# Altium project stm8core.PrjPCB
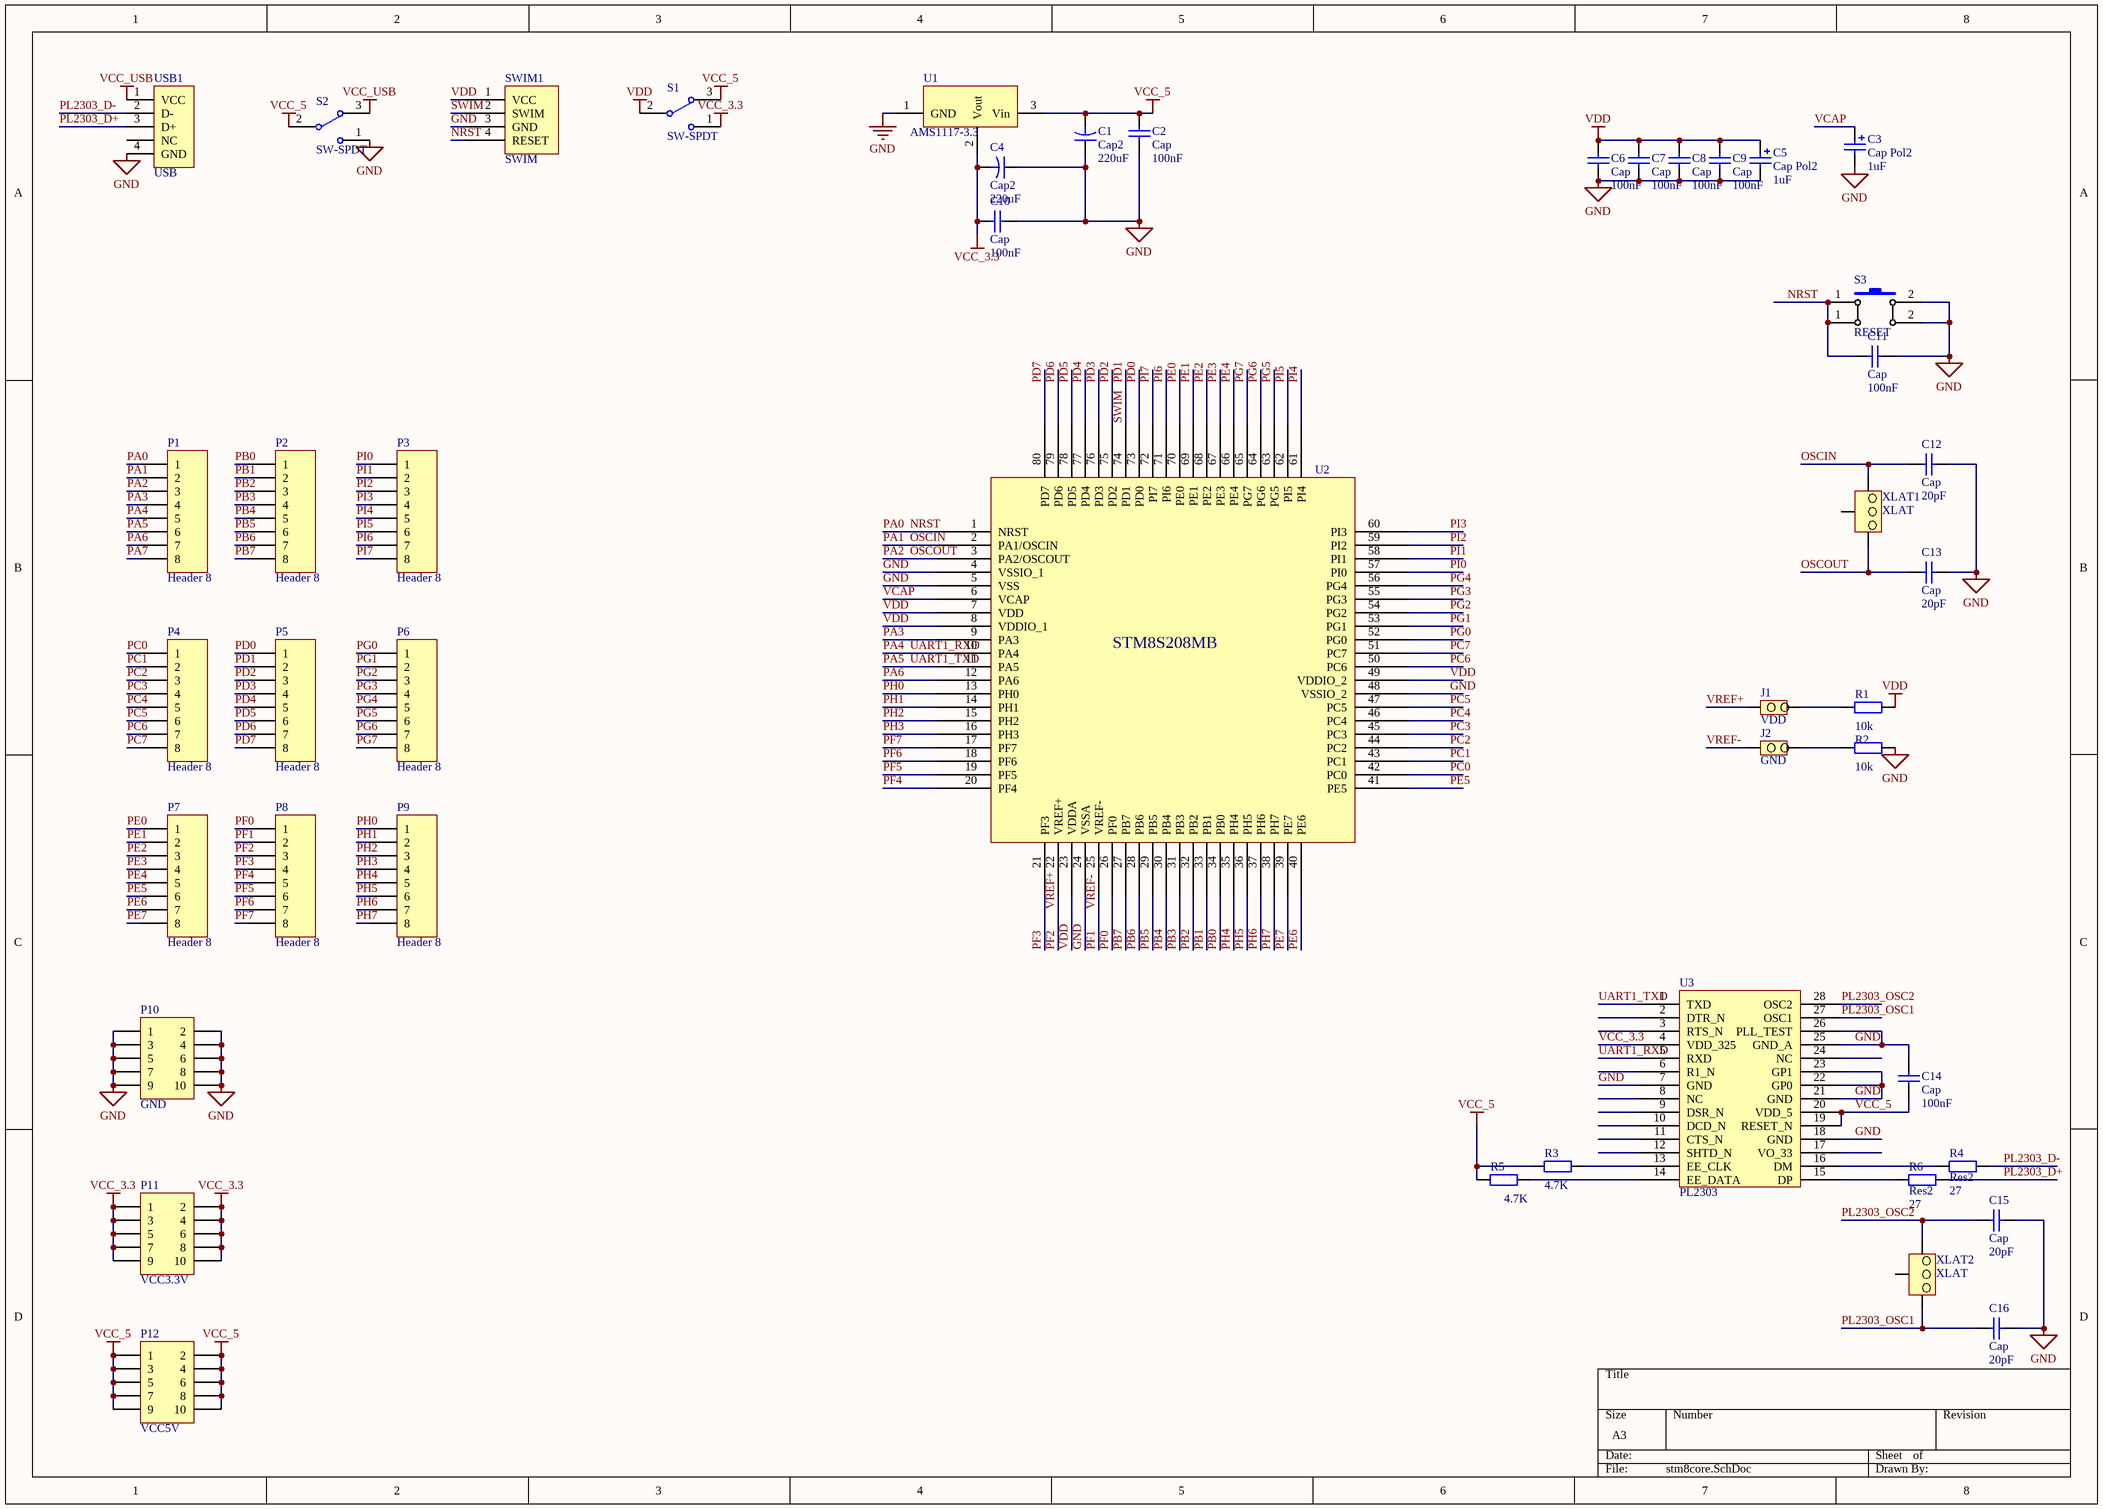
[diagram p0: stm8core.SchDoc]
1 sheet, 46 parts. Net scope: global (net labels, ports and power ports of the same name join across sheets).
Board file: stm8core.PcbDoc

## Sheet stm8core.SchDoc
size A3

### Parts
C1  Cap2  value 220uF  [RB-.1/.3]
C2  Cap  value 100nF  [0603]
C3  Cap Pol2  value 1uF  [3216]
C4  Cap2  value 220uF  [RB-.1/.3]
C5  Cap Pol2  value 1uF  [3216]
C6  Cap  value 100nF  [0603]
C7  Cap  value 100nF  [0603]
C8  Cap  value 100nF  [0603]
C9  Cap  value 100nF  [0603]
C10  Cap  value 100nF  [0603]
C11  Cap  value 100nF  [0603]
C12  Cap  value 20pF  [0603]
C13  Cap  value 20pF  [0603]
C14  Cap  value 100nF  [0603]
C15  Cap  value 20pF  [0603]
C16  Cap  value 20pF  [0603]
J1  VDD  [jumper]
J2  GND  [jumper]
P1  Header 8  [SIP8]
P2  Header 8  [SIP8]
P3  Header 8  [SIP8]
P4  Header 8  [SIP8]
P5  Header 8  [SIP8]
P6  Header 8  [SIP8]
P7  Header 8  [SIP8]
P8  Header 8  [SIP8]
P9  Header 8  [SIP8]
P10  GND  [HDR2X5]
P11  VCC3.3V  [HDR2X5]
P12  VCC5V  [HDR2X5]
R1  value 10k  [0603]  (hidden comment: Res2)
R2  value 10k  [0603]  (hidden comment: Res2)
R3  value 4.7K  [0603]  (hidden comment: Res2)
R4  Res2  value 27  [0603]
R5  value 4.7K  [0603]  (hidden comment: Res2)
R6  Res2  value 27  [0603]
S1  SW-SPDT  [sw3]
S2  SW-SPDT  [sw3]
S3  RESET  [SW-PB]
SWIM1  SWIM  [SIP4]
U1  AMS1117-3.3  [SOT-223]
U2  STM8S208MB  [LQFP80]  (value not drawn)
U3  PL2303  [SSOP28]
USB1  USB  [mini_USB]
XLAT1  XLAT  [XTAL]
XLAT2  XLAT  [XTAL]

### Nets
GND: C1.1 C2.1 C3.2 C4.1 C5.2 C6.1 C7.1 C8.1 C9.1 C10.1 C11.2 C12.2 C13.2 C14.2 C15.2 C16.2 P10.1 P10.2 P10.3 P10.4 P10.5 P10.6 P10.7 P10.8 P10.9 P10.10 R2.2 S2.1 S3.2 SWIM1.3(GND) U1.1(GND) U2.4(VSSIO_1) U2.5(VSS) U2.24(VSSA) U2.48(VSSIO_2) U3.7(GND) U3.18(GND) U3.21(GND) U3.22(GP0) U3.23(GP1) U3.25(GND_A) U3.26(PLL_TEST) USB1.4(GND)
VCC_3.3: C4.2 C10.2 P11.1 P11.2 P11.3 P11.4 P11.5 P11.6 P11.7 P11.8 P11.9 P11.10 S1.1 U1.2(Vout) U3.4(VDD_325)
VCC_5: C1.2 C2.2 C14.1 P12.1 P12.2 P12.3 P12.4 P12.5 P12.6 P12.7 P12.8 P12.9 P12.10 R3.1 R5.1 S1.3 S2.2 U1.3(Vin) U3.19(RESET_N) U3.20(VDD_5)
VCC_USB: S2.3 USB1.1(VCC)
VDD: C5.1 C6.2 C7.2 C8.2 C9.2 R1.2 S1.2 SWIM1.1(VCC) U2.7(VDD) U2.8(VDDIO_1) U2.23(VDDA) U2.49(VDDIO_2)
NRST: C11.1 P1.1 S3.1 SWIM1.4(RESET) U2.1(NRST)  [also labelled PA0]
OSCIN: C12.1 P1.2 U2.2(PA1/OSCIN) XLAT1.1  [also labelled PA1]
OSCOUT: C13.1 P1.3 U2.3(PA2/OSCOUT) XLAT1.2  [also labelled PA2]
PA3: P1.4 U2.9(PA3)
PA4: P1.5 U2.10(PA4) U3.5(RXD)  [also labelled UART1_RXD]
PA5: P1.6 U2.11(PA5) U3.1(TXD)  [also labelled UART1_TXD]
PA6: P1.7 U2.12(PA6)
PA7: P1.8
PB0: P2.1 U2.34(PB0)
PB1: P2.2 U2.33(PB1)
PB2: P2.3 U2.32(PB2)
PB3: P2.4 U2.31(PB3)
PB4: P2.5 U2.30(PB4)
PB5: P2.6 U2.29(PB5)
PB6: P2.7 U2.28(PB6)
PB7: P2.8 U2.27(PB7)
PC0: P4.1 U2.42(PC0)
PC1: P4.2 U2.43(PC1)
PC2: P4.3 U2.44(PC2)
PC3: P4.4 U2.45(PC3)
PC4: P4.5 U2.46(PC4)
PC5: P4.6 U2.47(PC5)
PC6: P4.7 U2.50(PC6)
PC7: P4.8 U2.51(PC7)
PD0: P5.1 U2.73(PD0)
PD1: P5.2 SWIM1.2(SWIM) U2.74(PD1)  [also labelled SWIM]
PD2: P5.3 U2.75(PD2)
PD3: P5.4 U2.76(PD3)
PD4: P5.5 U2.77(PD4)
PD5: P5.6 U2.78(PD5)
PD6: P5.7 U2.79(PD6)
PD7: P5.8 U2.80(PD7)
PE0: P7.1 U2.70(PE0)
PE1: P7.2 U2.69(PE1)
PE2: P7.3 U2.68(PE2)
PE3: P7.4 U2.67(PE3)
PE4: P7.5 U2.66(PE4)
PE5: P7.6 U2.41(PE5)
PE6: P7.7 U2.40(PE6)
PE7: P7.8 U2.39(PE7)
PF0: P8.1 U2.26(PF0)
PF1: J2.1 P8.2 U2.25(VREF-)  [also labelled VREF-]
PF2: J1.1 P8.3 U2.22(VREF+)  [also labelled VREF+]
PF3: P8.4 U2.21(PF3)
PF4: P8.5 U2.20(PF4)
PF5: P8.6 U2.19(PF5)
PF6: P8.7 U2.18(PF6)
PF7: P8.8 U2.17(PF7)
PG0: P6.1 U2.52(PG0)
PG1: P6.2 U2.53(PG1)
PG2: P6.3 U2.54(PG2)
PG3: P6.4 U2.55(PG3)
PG4: P6.5 U2.56(PG4)
PG5: P6.6 U2.63(PG5)
PG6: P6.7 U2.64(PG6)
PG7: P6.8 U2.65(PG7)
PH0: P9.1 U2.13(PH0)
PH1: P9.2 U2.14(PH1)
PH2: P9.3 U2.15(PH2)
PH3: P9.4 U2.16(PH3)
PH4: P9.5 U2.35(PH4)
PH5: P9.6 U2.36(PH5)
PH6: P9.7 U2.37(PH6)
PH7: P9.8 U2.38(PH7)
PI0: P3.1 U2.57(PI0)
PI1: P3.2 U2.58(PI1)
PI2: P3.3 U2.59(PI2)
PI3: P3.4 U2.60(PI3)
PI4: P3.5 U2.61(PI4)
PI5: P3.6 U2.62(PI5)
PI6: P3.7 U2.71(PI6)
PI7: P3.8 U2.72(PI7)
PL2303_D+: R6.2 USB1.3(D+)
PL2303_D-: R4.2 USB1.2(D-)
PL2303_OSC1: C16.1 U3.27(OSC1) XLAT2.2
PL2303_OSC2: C15.1 U3.28(OSC2) XLAT2.1
VCAP: C3.1 U2.6(VCAP)
NetJ1_2: J1.2 R1.1
NetJ2_2: J2.2 R2.1
NetR3_2: R3.2 U3.13(EE_CLK)
NetR4_1: R4.1 U3.16(DM)
NetR5_2: R5.2 U3.14(EE_DATA)
NetR6_1: R6.1 U3.15(DP)

Not connected (* = marked no-connect by the designer): U3 2(DTR_N) 3(RTS_N) 6(R1_N) 8(NC) 9(DSR_N) 10(DCD_N) 11(CTS_N) 12(SHTD_N) 17(VO_33) 24(NC); USB1 ?1(NC); XLAT1 ?1; XLAT2 ?1

### Library data of the parts
C1 C4 = Cap2: Capacitor; Published: 23-Sep-2002; PackageReference: CAPR5-4X5; Publisher: Altium Limited
C2 C6-C16 = Cap: Capacitor; Published: 8-Jun-2000; LatestRevisionDate: 17-Jul-2002; LatestRevisionNote: Re-released for DXP Platform.; PackageReference: RAD-0.3; Publisher: Altium Limited
C3 C5 = Cap Pol2: Polarized Capacitor (Axial); Published: 8-Jun-2000; LatestRevisionDate: 17-Jul-2002; LatestRevisionNote: Re-released for DXP Platform.; PackageReference: POLAR0.8; Publisher: Altium Limited
J1 J2 = JNMPER
P1-P9 = Header 8: Header, 8-Pin; LatestRevisionDate: 17-Jul-2002; LatestRevisionNote: Re-released for DXP Platform.; Publisher: Altium Limited
P10-P12 = Header 5X2: Header, 5-Pin, Dual row; LatestRevisionDate: 17-Jul-2002; LatestRevisionNote: Re-released for DXP Platform.; Publisher: Altium Limited
R1-R6 = Res2: Resistor; Published: 8-Jun-2000; LatestRevisionDate: 17-Jul-2002; LatestRevisionNote: Re-released for DXP Platform.; PackageReference: AXIAL-0.4; Publisher: Altium Limited
S1 S2 = SW-SPDT: SPDT Subminiature Toggle Switch, Right Angle Mounting, Vertical Actuation; Published: 24-Mar-1999; LatestRevisionDate: 17-Dec-2003; LatestRevisionNote: Schematic revised, PCB Footprint replaced.; DatasheetVersion: 05-Dec-2000; PackageReference: TL36WW15050; Publisher: Altium Limited; ComponentLink1Description: Manufacturer Link; ComponentLink1URL: http://www.apem.com
S3 = SW-PB: Switch; Published: 24-Mar-1999; LatestRevisionDate: 17-Jul-2002; LatestRevisionNote: Re-released for DXP Platform.; PackageReference: SPST-2; Publisher: Altium Limited
U2 = STM8
XLAT1 XLAT2 = MYXLAT